# EAGLE design RowDriver3 (EAGLE 6.3)
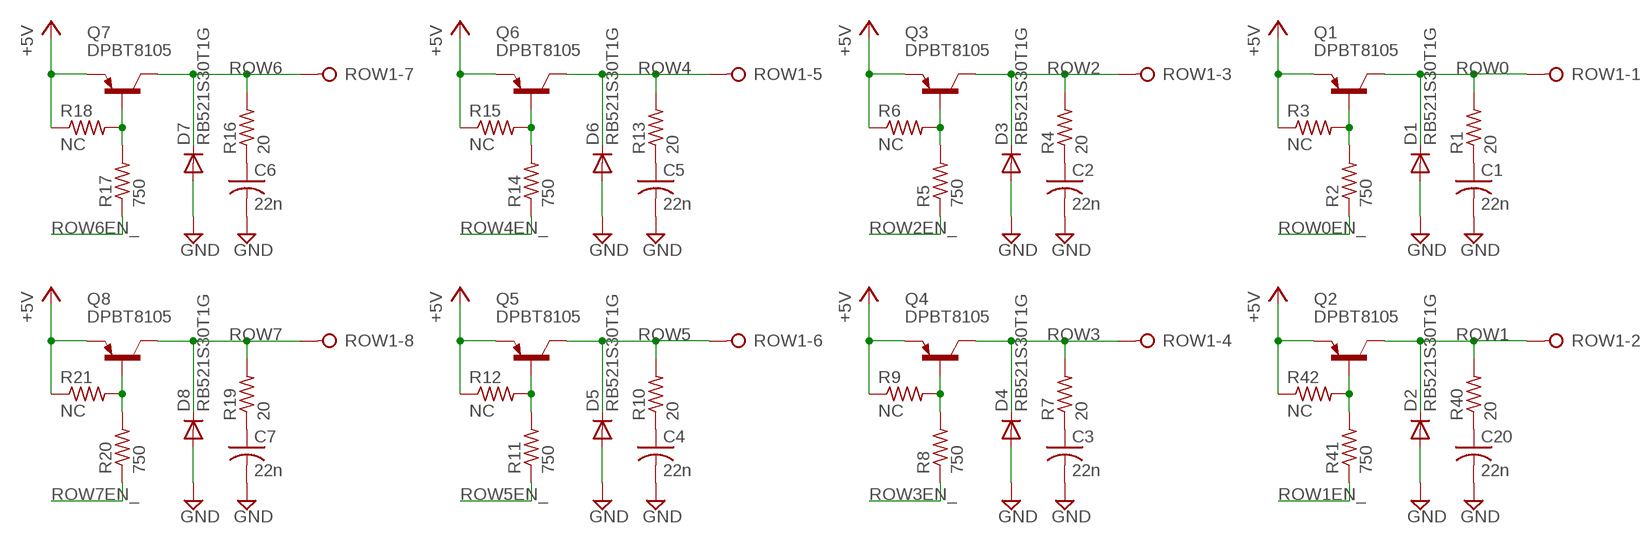
[diagram p0: schematic, sheet 1]

## Parts
C1  22n  C-USC0603  [C0603]
C2  22n  C-USC0603  [C0603]
C3  22n  C-USC0603  [C0603]
C4  22n  C-USC0603  [C0603]
C5  22n  C-USC0603  [C0603]
C6  22n  C-USC0603  [C0603]
C7  22n  C-USC0603  [C0603]
C20  22n  C-USC0603  [C0603]
D1  RB521S30T1G  DIODE-SOD523  [SOD523]
D2  RB521S30T1G  DIODE-SOD523  [SOD523]
D3  RB521S30T1G  DIODE-SOD523  [SOD523]
D4  RB521S30T1G  DIODE-SOD523  [SOD523]
D5  RB521S30T1G  DIODE-SOD523  [SOD523]
D6  RB521S30T1G  DIODE-SOD523  [SOD523]
D7  RB521S30T1G  DIODE-SOD523  [SOD523]
D8  RB521S30T1G  DIODE-SOD523  [SOD523]
Q1  DPBT8105  [SOT23]
Q2  DPBT8105  [SOT23]
Q3  DPBT8105  [SOT23]
Q4  DPBT8105  [SOT23]
Q5  DPBT8105  [SOT23]
Q6  DPBT8105  [SOT23]
Q7  DPBT8105  [SOT23]
Q8  DPBT8105  [SOT23]
R1  20  R-US_R0603  [R0603]
R2  750  R-US_R0603  [R0603]
R3  NC  R-US_R0603  [R0603]
R4  20  R-US_R0603  [R0603]
R5  750  R-US_R0603  [R0603]
R6  NC  R-US_R0603  [R0603]
R7  20  R-US_R0603  [R0603]
R8  750  R-US_R0603  [R0603]
R9  NC  R-US_R0603  [R0603]
R10  20  R-US_R0603  [R0603]
R11  750  R-US_R0603  [R0603]
R12  NC  R-US_R0603  [R0603]
R13  20  R-US_R0603  [R0603]
R14  750  R-US_R0603  [R0603]
R15  NC  R-US_R0603  [R0603]
R16  20  R-US_R0603  [R0603]
R17  750  R-US_R0603  [R0603]
R18  NC  R-US_R0603  [R0603]
R19  20  R-US_R0603  [R0603]
R20  750  R-US_R0603  [R0603]
R21  NC  R-US_R0603  [R0603]
R40  20  R-US_R0603  [R0603]
R41  750  R-US_R0603  [R0603]
R42  NC  R-US_R0603  [R0603]
ROW1  OSTVN08A150  [OSTVN08]

## Nets
+5V: Q1.2(E) Q2.2(E) Q3.2(E) Q4.2(E) Q5.2(E) Q6.2(E) Q7.2(E) Q8.2(E) R3.1 R6.1 R9.1 R12.1 R15.1 R18.1 R21.1 R42.1
GND: C1.2 C2.2 C3.2 C4.2 C5.2 C6.2 C7.2 C20.2 D1.A D2.A D3.A D4.A D5.A D6.A D7.A D8.A
N$1: Q1.1(B) R2.2 R3.2
N$2: C1.1 R1.1
N$3: Q3.1(B) R5.2 R6.2
N$4: C2.1 R4.1
N$5: Q4.1(B) R8.2 R9.2
N$6: C3.1 R7.1
N$7: Q5.1(B) R11.2 R12.2
N$8: C4.1 R10.1
N$9: Q6.1(B) R14.2 R15.2
N$10: C5.1 R13.1
N$11: Q7.1(B) R17.2 R18.2
N$12: C6.1 R16.1
N$13: Q8.1(B) R20.2 R21.2
N$14: C7.1 R19.1
N$33: Q2.1(B) R41.2 R42.2
N$34: C20.1 R40.1
ROW0: D1.C Q1.3(C) R1.2 ROW1.1
ROW0EN_: R2.1
ROW1: D2.C Q2.3(C) R40.2 ROW1.2
ROW1EN_: R41.1
ROW2: D3.C Q3.3(C) R4.2 ROW1.3
ROW2EN_: R5.1
ROW3: D4.C Q4.3(C) R7.2 ROW1.4
ROW3EN_: R8.1
ROW4: D6.C Q6.3(C) R13.2 ROW1.5
ROW4EN_: R14.1
ROW5: D5.C Q5.3(C) R10.2 ROW1.6
ROW5EN_: R11.1
ROW6: D7.C Q7.3(C) R16.2 ROW1.7
ROW6EN_: R17.1
ROW7: D8.C Q8.3(C) R19.2 ROW1.8
ROW7EN_: R20.1

## Library data of the parts
C1-C7 C20 = resistor:C-US: CAPACITOR, American symbol
D1-D8 = diode:DIODE-: DIODE
Q1-Q8 = Parts:DPBT8105: DPBT8105 1A PNP SURFACE MOUNT TRANSISTOR
R1-R21 R40-R42 = resistor:R-US_: RESISTOR, American symbol
ROW1 = Parts:OSTVN08A150: OSTVN08A150 0.1" Screw Terminal, 8 Position On Shore Technology, Inc.

## Board
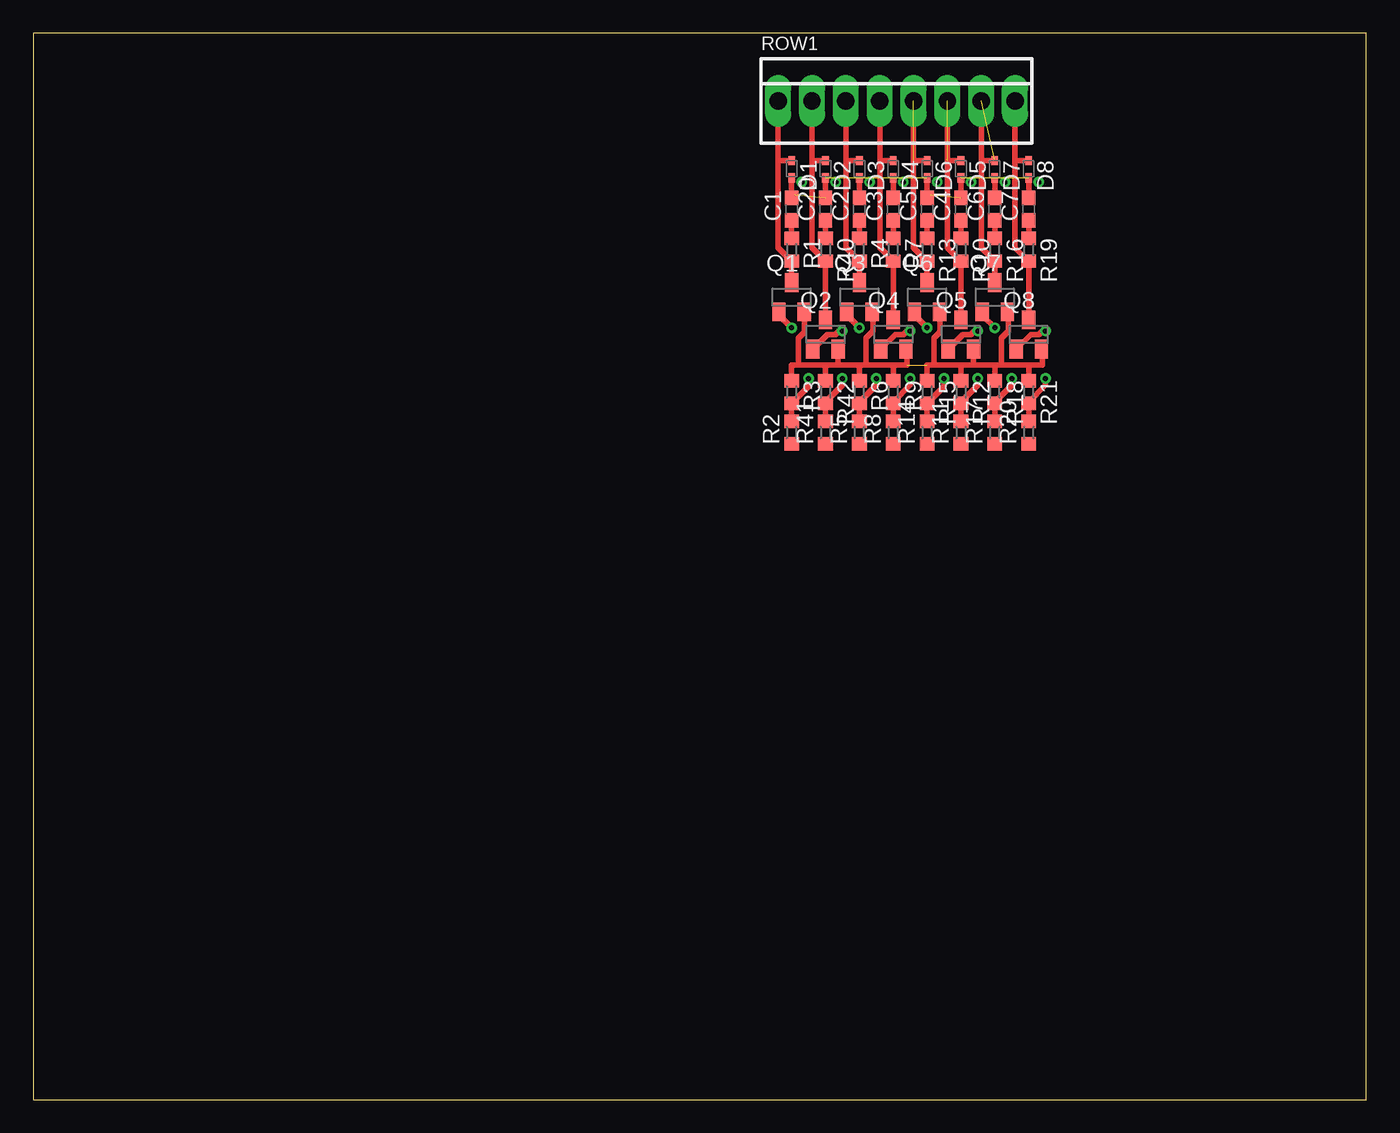
[diagram p1: board, top side]
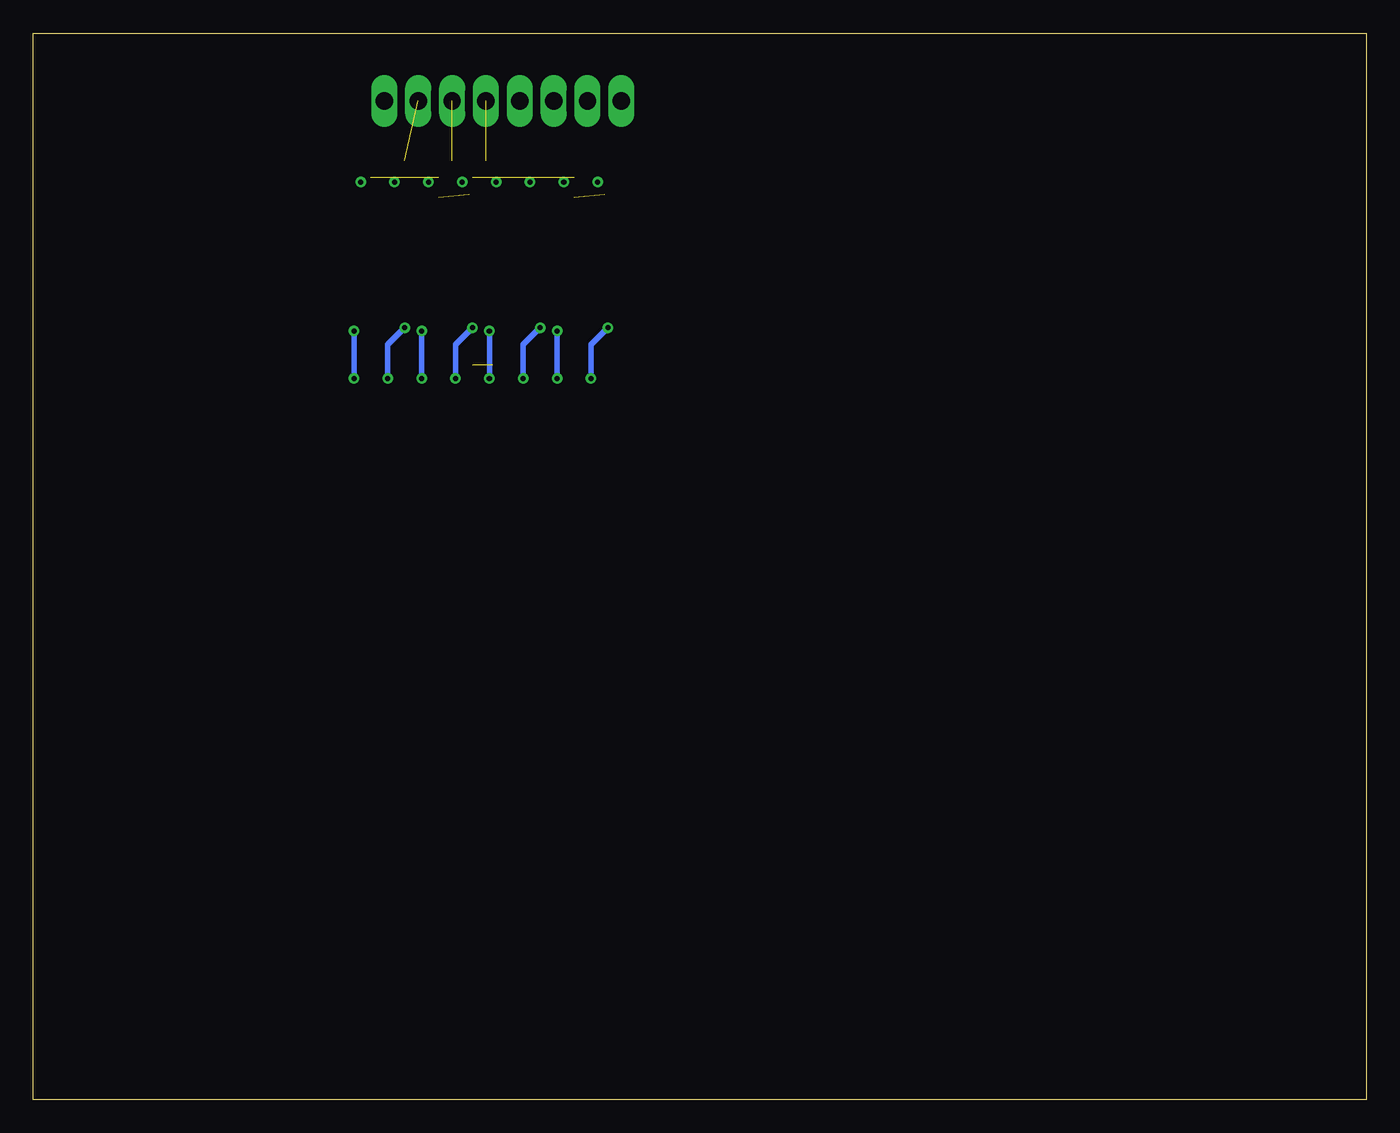
[diagram p2: board, bottom side, seen from below]

Size 100 x 80 mm. Coordinates in mm from the lower left corner, seen from the top.
Outline: 0,0 100,0 100,80 0,80 0,0
Copper layers (1*16): Top 0.035mm / dielectric 1.5mm / Bottom 0.035mm
Design rules "default": minimum track width 10mil, minimum drill 24mil, track to track 8mil, track to pad 8mil, pad to pad 8mil, via to via 8mil, smd to smd 8mil, copper to edge 40mil, drill to drill 8mil, minimum pad ring 10mil, minimum via ring 8mil, stop-mask expansion 4mil, vias tented up to drill 0mil, thermal gap 10mil

### Footprints (pad centres in the part's own frame; a part is rotated, then mirrored left to right if it is on the bottom)
C0603 = smd 1.1 x 1: 1 -0.85,0; 2 0.85,0
SOD523 = smd 0.7 x 0.5: A 0.7,0; C -0.6,0
SOT23 = smd 1 x 1.4: 1 -0.95,-1.1; 2 0.95,-1.1; 3 0,1.1
R0603 = smd 1 x 1.1: 1 -0.85,0; 2 0.85,0
OSTVN08 = drill 1.3 long: 1 -8.89,0; 2 -6.35,0; 3 -3.81,0; 4 -1.27,0; 5 1.27,0; 6 3.81,0; 7 6.35,0; 8 8.89,0

### Placement (x,y rotation side)
C1  56.9,66.8 90 top
C2  61.98,66.8 90 top
C3  64.52,66.8 90 top
C4  69.6,66.8 90 top
C5  67.06,66.8 90 top
C6  72.14,66.8 90 top
C7  74.68,66.8 90 top
C20  59.44,66.8 90 top
D1  56.9,69.85 270 top
D2  59.44,69.85 270 top
D3  61.98,69.85 270 top
D4  64.52,69.85 270 top
D5  69.6,69.85 270 top
D6  67.06,69.85 270 top
D7  72.14,69.85 270 top
D8  74.68,69.85 270 top
Q1  56.9,60.2 0 top
Q2  59.44,57.4 0 top
Q3  61.98,60.2 0 top
Q4  64.52,57.4 0 top
Q5  69.6,57.4 0 top
Q6  67.06,60.2 0 top
Q7  72.14,60.2 0 top
Q8  74.68,57.4 0 top
R1  56.9,63.75 270 top
R2  56.9,50.04 90 top
R3  56.9,53.09 270 top
R4  61.98,63.75 270 top
R5  61.98,50.04 90 top
R6  61.98,53.09 270 top
R7  64.52,63.75 270 top
R8  64.52,50.04 90 top
R9  64.52,53.09 270 top
R10  69.6,63.75 270 top
R11  69.6,50.04 90 top
R12  69.6,53.09 270 top
R13  67.06,63.75 270 top
R14  67.06,50.04 90 top
R15  67.06,53.09 270 top
R16  72.14,63.75 270 top
R17  72.14,50.04 90 top
R18  72.14,53.09 270 top
R19  74.68,63.75 270 top
R20  74.68,50.04 90 top
R21  74.68,53.09 270 top
R40  59.44,63.75 270 top
R41  59.44,50.04 90 top
R42  59.44,53.09 270 top
ROW1  64.77,74.93 0 top

### Tracks (layer width: path | path; a pad name or v marks a point on that pad's centre or on a via)
+5V  (1 unrouted)
  Top 0.406: Q1.2 57.85,57.59 57.4,57.15 57.4,55.12 | 57.4,55.12 56.9,55.12 R3.1 | 57.4,55.12 59.44,55.12 | 60.45,55.12 61.98,55.12 | 62.48,55.12 62.48,57.15 62.99,57.66 62.99,59.03 Q3.2 | Q2.2 60.39,55.18 60.45,55.12 | 62.48,55.12 64.52,55.12 | Q4.2 65.53,56.24 65.53,55.12 64.52,55.12 | 60.45,55.12 59.44,55.12 | 59.44,55.12 R42.1 | 62.48,55.12 61.98,55.12 | 61.98,55.12 R6.1 | 64.52,55.12 R9.1 | Q6.2 68.01,57.59 67.56,57.15 67.56,55.12 | 67.56,55.12 67.06,55.12 R15.1 | 67.56,55.12 69.6,55.12 | 70.61,55.12 72.14,55.12 | 72.64,55.12 72.64,57.15 73.15,57.66 73.15,59.03 Q7.2 | Q5.2 70.55,55.18 70.61,55.12 | 72.64,55.12 74.68,55.12 | Q8.2 75.69,56.24 75.69,55.12 74.68,55.12 | 70.61,55.12 69.6,55.12 | 69.6,55.12 R12.1 | 72.64,55.12 72.14,55.12 | 72.14,55.12 R18.1 | 74.68,55.12 R21.1
GND  (8 unrouted)
  Top 0.406: 71.12,69.15 71.12,74.93 | D1.A C1.2 57.15,67.91 | D2.A C20.2 | D3.A C2.2 | D4.A C3.2 | 67.31,67.91 C5.2 D6.A | D5.A C4.2 | D7.A C6.2 | D8.A C7.2
N$1  (via drill 0.38)
  Top 0.406: R2.2 R3.2 58.17,53.51 v58.17,54.1 | Q1.1 55.95,58.86 v56.9,57.91
  Bottom 0.406: v56.9,57.91 58.17,56.64 v58.17,54.1
N$2
  Top 0.406: R1.1 C1.1
N$3  (via drill 0.38)
  Top 0.406: R5.2 R6.2 61.98,52.32 63.25,53.59 v63.25,54.1 | Q3.1 61.03,58.86 v61.98,57.91
  Bottom 0.406: v63.25,54.1 63.25,56.64 v61.98,57.91
N$4
  Top 0.406: R4.1 C2.1
N$5  (via drill 0.38)
  Top 0.406: R8.2 R9.2 64.52,52.32 65.79,53.59 v65.79,54.1 | v65.79,57.66 65.53,57.66 65.28,57.4 64.67,57.4 Q4.1
  Bottom 0.406: v65.79,54.1 v65.79,57.66
N$6
  Top 0.406: R7.1 C3.1
N$7  (via drill 0.38)
  Top 0.406: R11.2 R12.2 69.6,52.32 70.87,53.59 v70.87,54.1 | v70.87,57.66 70.61,57.66 70.36,57.4 69.75,57.4 Q5.1
  Bottom 0.406: v70.87,54.1 v70.87,57.66
N$8
  Top 0.406: C4.1 R10.1
N$9  (via drill 0.38)
  Top 0.406: R14.2 R15.2 68.33,53.51 v68.33,54.1 | Q6.1 66.11,58.86 v67.06,57.91
  Bottom 0.406: v67.06,57.91 68.33,56.64 v68.33,54.1
N$10
  Top 0.406: R13.1 C5.1
N$11  (via drill 0.38)
  Top 0.406: R17.2 R18.2 72.14,52.32 73.41,53.59 v73.41,54.1 | Q7.1 71.19,58.86 v72.14,57.91
  Bottom 0.406: v73.41,54.1 73.41,56.64 v72.14,57.91
N$12
  Top 0.406: R16.1 C6.1
N$13  (via drill 0.38)
  Top 0.406: R20.2 R21.2 74.68,52.32 75.95,53.59 v75.95,54.1 | v75.95,57.66 75.69,57.66 75.44,57.4 74.83,57.4 Q8.1
  Bottom 0.406: v75.95,54.1 v75.95,57.66
N$14
  Top 0.406: R19.1 C7.1
N$15  (via drill 0.38)
  other vias: 57.66,68.83
N$16  (via drill 0.38)
  other vias: 60.2,68.83
N$17  (via drill 0.38)
  other vias: 62.74,68.83
N$18  (via drill 0.38)
  other vias: 65.28,68.83
N$27  (via drill 0.38)
  other vias: 70.87,57.66
N$28  (via drill 0.38)
  other vias: 72.14,57.91
N$29  (via drill 0.38)
  other vias: 67.06,57.91
N$30  (via drill 0.38)
  other vias: 75.95,57.66
N$31  (via drill 0.38)
  other vias: 68.33,54.1
N$32  (via drill 0.38)
  other vias: 70.87,54.1
N$33  (via drill 0.38)
  Top 0.406: R41.2 R42.2 59.44,52.32 60.71,53.59 v60.71,54.1 | v60.71,57.66 60.45,57.66 60.2,57.4 59.59,57.4 Q2.1
  Bottom 0.406: v60.71,54.1 v60.71,57.66
N$34
  Top 0.406: C20.1 R40.1
N$35  (via drill 0.38)
  other vias: 73.41,54.1
N$36  (via drill 0.38)
  other vias: 75.95,54.1
N$37  (via drill 0.38)
  other vias: 67.82,68.83
N$38  (via drill 0.38)
  other vias: 70.36,68.83
N$39  (via drill 0.38)
  other vias: 72.9,68.83
N$40  (via drill 0.38)
  other vias: 75.44,68.83
ROW0
  Top 0.406: ROW1.1 55.88,70.45 | 55.88,70.45 D1.C | 55.88,70.45 55.88,63.92 R1.2 Q1.3
ROW1
  Top 0.406: 58.42,70.45 58.42,63.92 R40.2 Q2.3 | D2.C 58.42,70.45 | ROW1.2 58.42,70.45
ROW2
  Top 0.406: ROW1.3 60.96,70.45 | 60.96,70.45 60.96,63.92 R4.2 Q3.3 | D3.C 60.96,70.45
ROW3
  Top 0.406: ROW1.4 63.5,70.36 | 63.5,70.36 63.5,63.92 R7.2 Q4.3 | D4.C 63.59,70.45 63.5,70.36
ROW4  (1 unrouted)
  Top 0.406: D6.C 66.04,70.45 66.04,63.92 R13.2 Q6.3
ROW5  (1 unrouted)
  Top 0.406: D5.C 68.58,70.45 68.58,63.92 R10.2 Q5.3
ROW6  (1 unrouted)
  Top 0.406: D7.C 71.12,70.45 71.12,63.92 R16.2 Q7.3
ROW7
  Top 0.406: Q8.3 R19.2 73.66,63.92 73.66,70.36 73.75,70.45 D8.C 73.66,70.45 ROW1.8
S$1
  Top 0.406: 66.04,69.15 66.04,74.93
S$2
  Top 0.406: 68.58,69.15 68.58,74.93
S$4  (via drill 0.38)
  other vias: 61.98,57.91
S$5  (via drill 0.38)
  other vias: 60.71,54.1
S$6  (via drill 0.38)
  other vias: 65.79,57.66
S$7  (via drill 0.38)
  other vias: 65.79,54.1
S$8  (via drill 0.38)
  other vias: 58.17,54.1
S$9  (via drill 0.38)
  other vias: 63.25,54.1
S$10  (via drill 0.38)
  other vias: 60.71,57.66
S$11  (via drill 0.38)
  other vias: 56.9,57.91
S$15
  Top 0.406: 67.06,49.28 67.31,49.28 67.31,49.53